# Altium schematic sheet fpga-inside.SchDoc
size Letter; CheckedBy: E. Chiu; CompanyName: Brinton Engineering, LLC; DrawnBy: J. Brinton; Engineer: J. Brinton; Address1: 3479 Edison Way; Address2: Menlo Park CA 94025; Address3: +1 (877) 778-8435; Address4: brintonengineering.com; Revision: 1; SheetNumber: 6; SheetTotal: 60
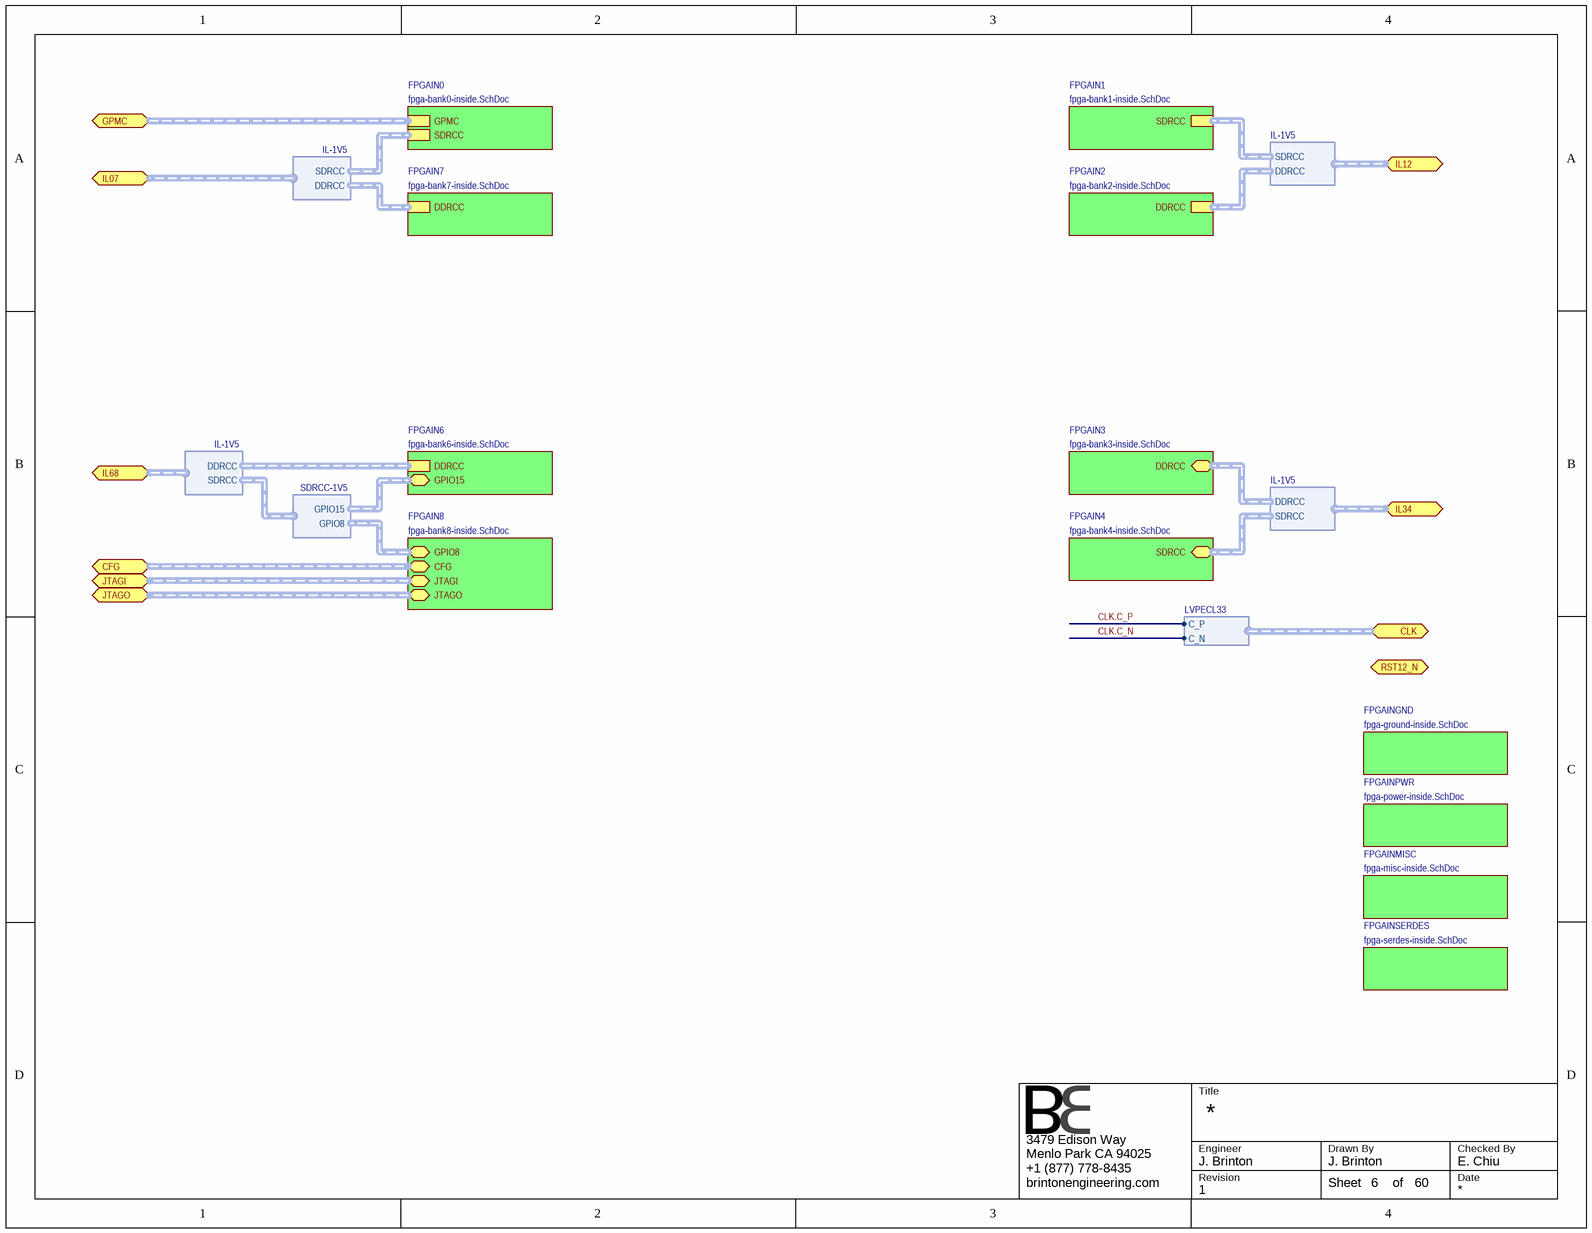
[diagram p0: fpga-inside.SchDoc]

## Sub-sheets
FPGAIN0 = fpga-bank0-inside.SchDoc: GPMC (harness GPMC), SDRCC (harness SDRCC-1V5)
FPGAIN1 = fpga-bank1-inside.SchDoc: SDRCC (harness SDRCC-1V5)
FPGAIN2 = fpga-bank2-inside.SchDoc: DDRCC (harness DDRCC-1V5)
FPGAIN3 = fpga-bank3-inside.SchDoc: DDRCC (harness DDRCC-1V5)
FPGAIN4 = fpga-bank4-inside.SchDoc: SDRCC (harness SDRCC-1V5)
FPGAIN6 = fpga-bank6-inside.SchDoc: DDRCC (harness DDRCC-1V5), GPIO15 (harness GPIO15-1V5)
FPGAIN7 = fpga-bank7-inside.SchDoc: DDRCC (harness DDRCC-1V5)
FPGAIN8 = fpga-bank8-inside.SchDoc: CFG (harness CFG-1V5), GPIO8 (harness GPIO8-1V5), JTAGI (harness JTAG-1V5), JTAGO (harness JTAG-1V5)
FPGAINGND = fpga-ground-inside.SchDoc: no entries
FPGAINMISC = fpga-misc-inside.SchDoc: no entries
FPGAINPWR = fpga-power-inside.SchDoc: no entries
FPGAINSERDES = fpga-serdes-inside.SchDoc: no entries

## Ports
CFG (harness CFG-1V5), CLK (harness LVPECL33), GPMC (harness GPMC), IL07 (harness IL-1V5), IL12 (harness IL-1V5), IL34 (harness IL-1V5), IL68 (harness IL-1V5), JTAGI (harness JTAG-1V5), JTAGO (harness JTAG-1V5), RST12_N (in)

## Harnesses
IL-1V5: DDRCC, SDRCC
SDRCC-1V5: GPIO15, GPIO8
LVPECL33: C_P, C_N

## Nets
CLK.C_N: port CLK.C_N
CLK.C_P: port CLK.C_P

## Buses and harness runs
harness port CFG = sheet FPGAIN8/CFG
harness port GPMC = sheet FPGAIN0/GPMC
harness port JTAGI = sheet FPGAIN8/JTAGI
harness port JTAGO = sheet FPGAIN8/JTAGO

## Notes on the sheet
- Title
- Engineer
- Revision
- Drawn By
- Checked By
- Date
- Sheet
- of